# Altium project DESIGN1.PrjPcb
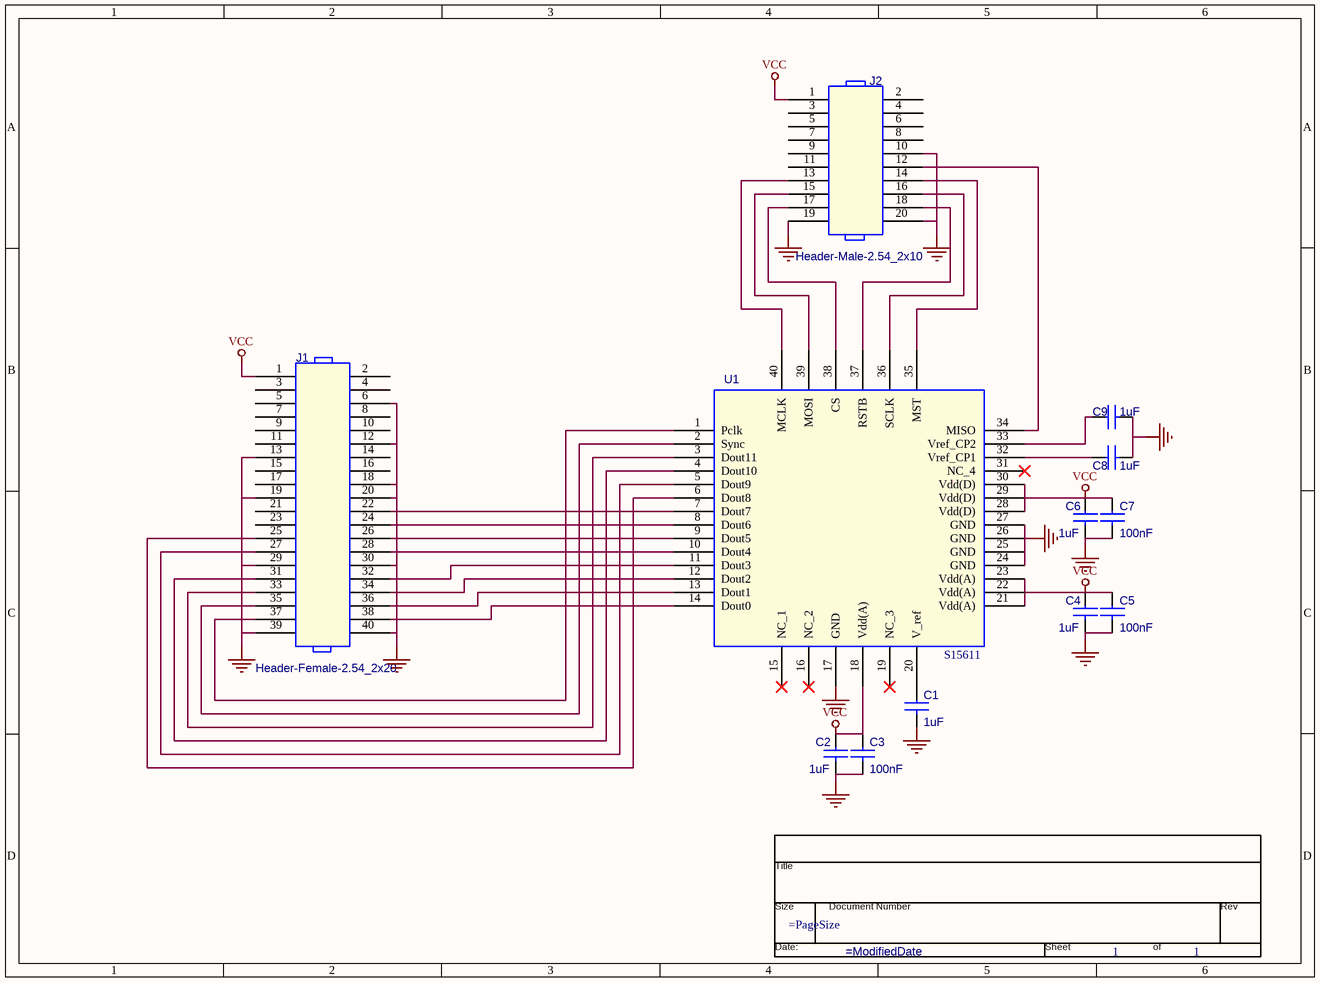
[diagram p0: PAGE1.SchDoc]
1 sheet, 13 parts. Net scope: global (net labels, ports and power ports of the same name join across sheets).

## Sheet PAGE1.SchDoc
size 246 x 182 mm; Page Create Date: March  8, 1995; Page Number: 1; Page Size: A; Comment: TitleBlock0; Page Count: 1; DsnPath: E:\Dropbox\Rodgel\Projects\1402\Triangle-TeraHertz\Sensor\DESIGN1.DSN; SchematicName: SCHEMATIC1; PageName: PAGE1; PageSize: A; TopSchematic: True

### Parts
*  Page Count: 1  (hidden comment: TitleBlock0)  (graphical)
C1  value 1uF  [0603]  (hidden comment: CAPACITOR NON-POL)
C2  value 1uF  [0603]  (hidden comment: CAPACITOR NON-POL)
C3  value 100nF  [0603]  (hidden comment: CAPACITOR NON-POL)
C4  value 1uF  [0603]  (hidden comment: CAPACITOR NON-POL)
C5  value 100nF  [0603]  (hidden comment: CAPACITOR NON-POL)
C6  value 1uF  [0603]  (hidden comment: CAPACITOR NON-POL)
C7  value 100nF  [0603]  (hidden comment: CAPACITOR NON-POL)
C8  value 1uF  [0603]  (hidden comment: CAPACITOR NON-POL)
C9  value 1uF  [0603]  (hidden comment: CAPACITOR NON-POL)
J1  value Header-Female-2.54_2x20  [HDR2x20]  (hidden comment: HEADER 20X2)
J2  value Header-Male-2.54_2x10  [HDR2x10]  (hidden comment: HEADER 10X2)
U1  S15611  [S15611_FP]

### Nets
GND: C1.2 C2.2 C3.2 C4.2 C5.2 C6.2 C7.2 C8.2 C9.2 J1.6 J1.12 J1.13 J1.18 J1.19 J1.20 J1.29 J1.30 J1.39 J1.40 J2.10 J2.19 J2.20 U1.17(GND) U1.24(GND) U1.25(GND) U1.26(GND) U1.27(GND)
VCC: C2.1 C3.1 C4.1 C5.1 C6.1 C7.1 J1.1 J2.1 U1.18(Vdd(A)) U1.21(Vdd(A)) U1.22(Vdd(A)) U1.23(Vdd(A)) U1.28(Vdd(D)) U1.29(Vdd(D)) U1.30(Vdd(D))
NetC1_1: C1.1 U1.20(V_ref)
NetC8_1: C8.1 U1.32(Vref_CP1)
NetC9_1: C9.1 U1.33(Vref_CP2)
NetJ1_22: J1.22 U1.7(Dout7)
NetJ1_24: J1.24 U1.8(Dout6)
NetJ1_25: J1.25 U1.6(Dout8)
NetJ1_26: J1.26 U1.9(Dout5)
NetJ1_27: J1.27 U1.5(Dout9)
NetJ1_28: J1.28 U1.10(Dout4)
NetJ1_31: J1.31 U1.4(Dout10)
NetJ1_32: J1.32 U1.11(Dout3)
NetJ1_33: J1.33 U1.3(Dout11)
NetJ1_34: J1.34 U1.12(Dout2)
NetJ1_35: J1.35 U1.2(Sync)
NetJ1_36: J1.36 U1.13(Dout1)
NetJ1_37: J1.37 U1.1(Pclk)
NetJ1_38: J1.38 U1.14(Dout0)
NetJ2_12: J2.12 U1.34(MISO)
NetJ2_13: J2.13 U1.40(MCLK)
NetJ2_14: J2.14 U1.35(MST)
NetJ2_15: J2.15 U1.39(MOSI)
NetJ2_16: J2.16 U1.36(SCLK)
NetJ2_17: J2.17 U1.38(CS)
NetJ2_18: J2.18 U1.37(RSTB)

Not connected (* = marked no-connect by the designer): J1 2 3 4 5 7 8 9 10 11 14 15 16 17 21 23; J2 2 3 4 5 6 7 8 9 11; U1 15(NC_1)* 16(NC_2)* 19(NC_3)* 31(NC_4)*

### Notes on the sheet
- (in symbol TitleBlock0) Title; Size; Document Number; Rev; Date:; Sheet; of

### Library data of the parts
C1 = CAPACITOR NON-POL: Part Reference: C1; PCB Footprint: 0603
C2 = CAPACITOR NON-POL: Part Reference: C2; PCB Footprint: 0603
C3 = CAPACITOR NON-POL: Part Reference: C3; PCB Footprint: 0603
C4 = CAPACITOR NON-POL: Part Reference: C4; PCB Footprint: 0603
C5 = CAPACITOR NON-POL: Part Reference: C5; PCB Footprint: 0603
C6 = CAPACITOR NON-POL: Part Reference: C6; PCB Footprint: 0603
C7 = CAPACITOR NON-POL: Part Reference: C7; PCB Footprint: 0603
C8 = CAPACITOR NON-POL: Part Reference: C8; PCB Footprint: 0603
C9 = CAPACITOR NON-POL: Part Reference: C9; PCB Footprint: 0603
J1 = HEADER 20X2: Part Reference: J1; PCB Footprint: HDR2x20
J2 = HEADER 10X2: Part Reference: J2; PCB Footprint: HDR2x10
U1 = S15611: Part Reference: U1; Value: S15611; PCB Footprint: S15611_FP
* = TitleBlock0: Page Number: 1; Page Size: =PageSize; Page Create Date: March  8, 1995; Page Modify Date: =ModifiedDate